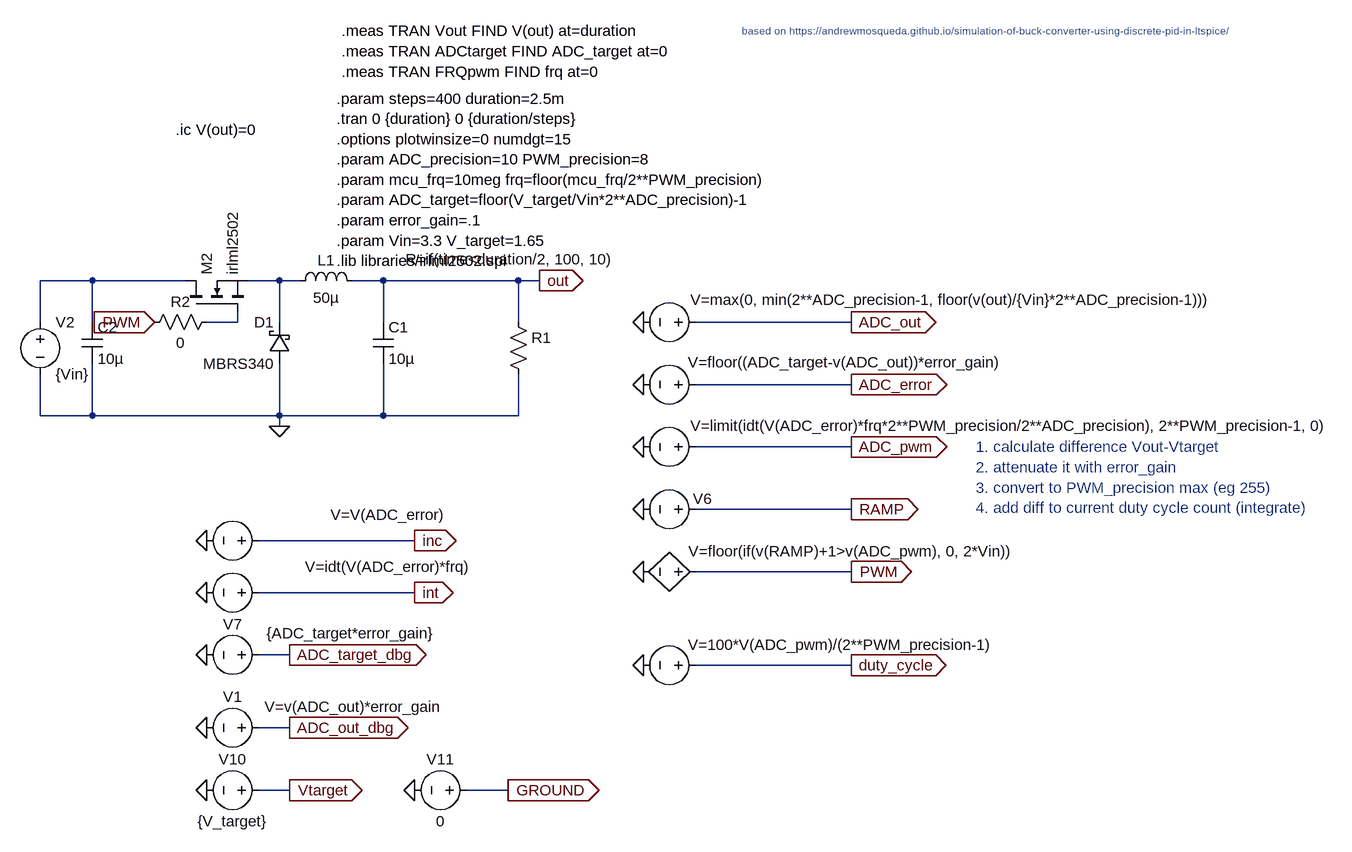
[diagram p0: schematic buck-basic.asc]
buck-basic.asc, the LTspice schematic file:
Version 4
SHEET 1 1892 1116
WIRE -32 272 -112 272
WIRE 112 272 -32 272
WIRE 256 272 208 272
WIRE 288 272 256 272
WIRE 416 272 368 272
WIRE 624 272 416 272
WIRE 656 272 624 272
WIRE -112 336 -112 272
WIRE -32 336 -32 272
WIRE 192 336 192 320
WIRE 192 336 144 336
WIRE 256 336 256 272
WIRE 416 336 416 272
WIRE 624 336 624 272
WIRE 1136 336 896 336
WIRE 1136 432 896 432
WIRE -112 480 -112 416
WIRE -32 480 -32 400
WIRE -32 480 -112 480
WIRE 256 480 256 400
WIRE 256 480 -32 480
WIRE 416 480 416 400
WIRE 416 480 256 480
WIRE 624 480 624 416
WIRE 624 480 416 480
WIRE 256 496 256 480
WIRE 1136 528 896 528
WIRE 1136 624 896 624
WIRE 464 672 224 672
WIRE 1136 720 896 720
WIRE 464 752 224 752
WIRE 272 848 224 848
WIRE 1136 864 896 864
WIRE 272 960 224 960
WIRE 272 1056 224 1056
WIRE 608 1056 544 1056
FLAG 256 496 0
FLAG 656 272 out
IOPIN 656 272 Out
FLAG 816 336 0
FLAG 1136 336 ADC_out
IOPIN 1136 336 Out
FLAG 1136 432 ADC_error
IOPIN 1136 432 Out
FLAG 816 432 0
FLAG 1136 528 ADC_pwm
IOPIN 1136 528 Out
FLAG 816 528 0
FLAG 816 624 0
FLAG 1136 624 RAMP
IOPIN 1136 624 Out
FLAG 816 720 0
FLAG 1136 720 PWM
IOPIN 1136 720 Out
FLAG 64 336 PWM
IOPIN 64 336 In
FLAG 464 672 inc
IOPIN 464 672 Out
FLAG 144 672 0
FLAG 464 752 int
IOPIN 464 752 Out
FLAG 144 752 0
FLAG 144 848 0
FLAG 272 848 ADC_target_dbg
IOPIN 272 848 Out
FLAG 272 960 ADC_out_dbg
IOPIN 272 960 Out
FLAG 144 960 0
FLAG 144 1056 0
FLAG 272 1056 Vtarget
IOPIN 272 1056 Out
FLAG 464 1056 0
FLAG 608 1056 GROUND
IOPIN 608 1056 Out
FLAG 1136 864 duty_cycle
IOPIN 1136 864 Out
FLAG 816 864 0
SYMBOL Cap 400 336 R0
SYMATTR InstName C1
SYMATTR Value 10µ
SYMATTR SpiceLine Rser=.1
SYMBOL ind 272 288 R270
WINDOW 0 32 56 VTop 2
WINDOW 3 5 56 VBottom 2
SYMATTR InstName L1
SYMATTR Value 50µ
SYMATTR SpiceLine Rser=.05
SYMBOL schottky 272 400 R180
WINDOW 0 24 64 Left 2
WINDOW 3 24 0 Left 2
SYMATTR InstName D1
SYMATTR Value MBRS340
SYMATTR Description Diode
SYMATTR Type diode
SYMBOL Res 608 320 R0
WINDOW 3 -158 -81 Left 2
SYMATTR Value R=if(time<duration/2, 100, 10)
SYMATTR InstName R1
SYMBOL Voltage -112 320 R0
SYMATTR InstName V2
SYMATTR Value {Vin}
SYMBOL nmos 112 320 R270
SYMATTR InstName M2
SYMATTR Value irlml2502
SYMATTR Prefix X
SYMBOL Voltage 912 336 R90
WINDOW 0 -32 56 Invisible 2
WINDOW 3 -50 -381 VTop 2
SYMATTR InstName V3
SYMATTR Value V=max(0, min(2**ADC_precision-1, floor(v(out)/{Vin}*2**ADC_precision-1)))
SYMATTR Prefix B
SYMBOL Voltage 912 432 R90
WINDOW 0 -32 56 Invisible 2
WINDOW 3 -50 -218 VTop 2
SYMATTR InstName V4
SYMATTR Value V=floor((ADC_target-v(ADC_out))*error_gain)
SYMATTR Prefix B
SYMBOL Voltage 912 528 R90
WINDOW 0 -32 56 Invisible 2
WINDOW 3 -48 -470 VTop 2
SYMATTR InstName V5
SYMATTR Value V=limit(idt(V(ADC_error)*frq*2**PWM_precision/2**ADC_precision), 2**PWM_precision-1, 0)
SYMATTR Prefix B
SYMBOL voltage 912 624 R90
WINDOW 0 -16 -10 VRight 2
WINDOW 3 6 -10 Invisible 2
WINDOW 123 0 0 Left 0
WINDOW 39 0 0 Left 0
SYMATTR InstName V6
SYMATTR Value PULSE(0 {floor(mcu_frq/frq-1)} 1n {(1/frq)-2n} 1n 1n {1/frq})
SYMBOL bv 912 720 R90
WINDOW 0 -32 56 Invisible 2
WINDOW 3 -47 -225 VTop 2
SYMATTR InstName B1
SYMATTR Value V=floor(if(v(RAMP)+1>v(ADC_pwm), 0, 2*Vin))
SYMBOL Voltage 240 672 R90
WINDOW 0 -32 56 Invisible 2
WINDOW 3 -55 -184 VTop 2
SYMATTR InstName V8
SYMATTR Value V=V(ADC_error)
SYMATTR Prefix B
SYMBOL Voltage 240 752 R90
WINDOW 0 -32 56 Invisible 2
WINDOW 3 -55 -184 VTop 2
SYMATTR InstName V9
SYMATTR Value V=idt(V(ADC_error)*frq)
SYMATTR Prefix B
SYMBOL Voltage 240 848 R90
WINDOW 0 -32 56 VBottom 2
WINDOW 3 -49 -128 VTop 2
SYMATTR InstName V7
SYMATTR Value {ADC_target*error_gain}
SYMBOL Res 160 320 R90
WINDOW 0 0 56 VBottom 2
WINDOW 3 32 56 VTop 2
SYMATTR InstName R2
SYMATTR Value 0
SYMBOL Cap -48 336 R0
SYMATTR InstName C2
SYMATTR Value 10µ
SYMATTR SpiceLine Rser=.1
SYMBOL Voltage 240 960 R90
WINDOW 0 -32 56 VBottom 2
WINDOW 3 -48 -131 VTop 2
SYMATTR InstName V1
SYMATTR Value V=v(ADC_out)*error_gain
SYMATTR Prefix B
SYMBOL Voltage 240 1056 R90
WINDOW 0 -32 56 VBottom 2
WINDOW 3 32 56 VTop 2
SYMATTR InstName V10
SYMATTR Value {V_target}
SYMBOL Voltage 560 1056 R90
WINDOW 0 -32 56 VBottom 2
WINDOW 3 32 56 VTop 2
SYMATTR InstName V11
SYMATTR Value 0
SYMBOL Voltage 912 864 R90
WINDOW 0 -32 56 Invisible 2
WINDOW 3 -47 -209 VTop 2
SYMATTR InstName V12
SYMATTR Value V=100*V(ADC_pwm)/(2**PWM_precision-1)
SYMATTR Prefix B
TEXT 344 -8 Left 2 !.param steps=400 duration=2.5m\n.tran 0 {duration} 0 {duration/steps}\n.options plotwinsize=0 numdgt=15\n.param ADC_precision=10 PWM_precision=8\n.param mcu_frq=10meg frq=floor(mcu_frq/2**PWM_precision)\n.param ADC_target=floor(V_target/Vin*2**ADC_precision)-1\n.param error_gain=.1\n.param Vin=3.3 V_target=1.65\n.lib libraries/irlml2502.spi
TEXT 96 40 Left 2 !.ic V(out)=0
TEXT 352 -112 Left 2 !.meas TRAN Vout FIND V(out) at=duration\n.meas TRAN ADCtarget FIND ADC_target at=0\n.meas TRAN FRQpwm FIND frq at=0
TEXT 1328 528 Left 2 ;1. calculate difference Vout-Vtarget\n2. attenuate it with error_gain\n3. convert to PWM_precision max (eg 255)\n4. add diff to current duty cycle count (integrate)
TEXT 968 -112 Left 1 ;based on https://andrewmosqueda.github.io/simulation-of-buck-converter-using-discrete-pid-in-ltspice/

The netlist it stands for:
* buck-basic.asc
C1 out 0 10µ Rser=.1
L1 N002 out 50µ Rser=.05
D1 0 N002 MBRS340
R1 out 0 R=if(time<duration/2, 100, 10)
V2 N001 0 {Vin}
XM2 N001 N003 N002 irlml2502  ; pins D G S
B§V3 ADC_out 0 V=max(0, min(2**ADC_precision-1, floor(v(out)/{Vin}*2**ADC_precision-1)))
B§V4 ADC_error 0 V=floor((ADC_target-v(ADC_out))*error_gain)
B§V5 ADC_pwm 0 V=limit(idt(V(ADC_error)*frq*2**PWM_precision/2**ADC_precision), 2**PWM_precision-1, 0)
V6 RAMP 0 PULSE(0 {floor(mcu_frq/frq-1)} 1n {(1/frq)-2n} 1n 1n {1/frq})
B1 PWM 0 V=floor(if(v(RAMP)+1>v(ADC_pwm), 0, 2*Vin))
B§V8 inc 0 V=V(ADC_error)
B§V9 int 0 V=idt(V(ADC_error)*frq)
V7 ADC_target_dbg 0 {ADC_target*error_gain}
R2 N003 PWM 0
C2 N001 0 10µ Rser=.1
B§V1 ADC_out_dbg 0 V=v(ADC_out)*error_gain
V10 Vtarget 0 {V_target}
V11 GROUND 0 0
B§V12 duty_cycle 0 V=100*V(ADC_pwm)/(2**PWM_precision-1)
.model D D
.lib standard.dio
.param steps=400 duration=2.5m
.tran 0 {duration} 0 {duration/steps}
.options plotwinsize=0 numdgt=15
.param ADC_precision=10 PWM_precision=8
.param mcu_frq=10meg frq=floor(mcu_frq/2**PWM_precision)
.param ADC_target=floor(V_target/Vin*2**ADC_precision)-1
.param error_gain=.1
.param Vin=3.3 V_target=1.65
.lib libraries/irlml2502.spi
.ic V(out)=0
.meas TRAN Vout FIND V(out) at=duration
.meas TRAN ADCtarget FIND ADC_target at=0
.meas TRAN FRQpwm FIND frq at=0
* 1. calculate difference Vout-Vtarget
* 2. attenuate it with error_gain
* 3. convert to PWM_precision max (eg 255)
* 4. add diff to current duty cycle count (integrate)
* based on https://andrewmosqueda.github.io/simulation-of-buck-converter-using-discrete-pid-in-ltspice/
.backanno
.end